# Altium schematic sheet DO_EZO_2.SchDoc
size A4
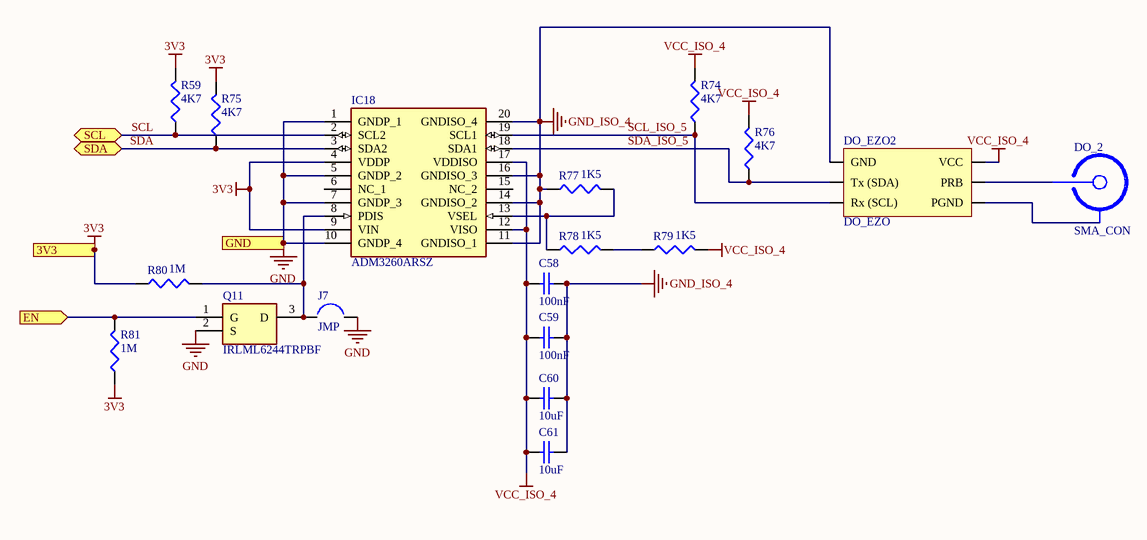
[diagram p0: DO_EZO_2.SchDoc]

## Parts
C58  100nF  [1608[0603]]
C59  100nF  [1608[0603]]
C60  10uF  [1608[0603]]
C61  10uF  [1608[0603]]
DO_2  SMA_CON  [PCBSMAFRAHT]
DO_EZO2  DO_EZO  [DO_EZO]
IC18  ADM3260ARSZ  [SOP65P780X200-20N]
J7  JMP  [Jumper]
Q11  IRLML6244TRPBF  [SOT95P237X112-3N]
R59  4K7  [J1-0603]
R74  4K7  [J1-0603]
R75  4K7  [J1-0603]
R76  4K7  [J1-0603]
R77  1K5  [J1-0603]
R78  1K5  [J1-0603]
R79  1K5  [J1-0603]
R80  1M  [J1-0603]
R81  1M  [J1-0603]

## Ports
3V3, EN (in), GND, SCL (bidir), SDA (bidir)

## Nets
3V3: IC18.4(VDDP) IC18.9(VIN) R59.2 R75.2 R80.1 R81.1 ; port 3V3
GND: IC18.1(GNDP_1) IC18.5(GNDP_2) IC18.7(GNDP_3) IC18.10(GNDP_4) J7.2 Q11.2(S) ; port GND
GND_ISO_4: C58.2 C59.2 C60.2 C61.2 DO_EZO2.1(GND) IC18.11(GNDISO_1) IC18.14(GNDISO_2) IC18.16(GNDISO_3) IC18.20(GNDISO_4) R77.1
VCC_ISO_4: C58.1 C59.1 C60.1 C61.1 DO_EZO2.4(VCC) IC18.12(VISO) IC18.17(VDDISO) R74.2 R76.2 R79.2
EN: Q11.1(G) R81.2 ; port EN
SCL: IC18.2(SCL2) R59.1 ; port SCL
SCL_ISO_5: DO_EZO2.3(Rx_(SCL)) IC18.19(SCL1) R74.1
SDA: IC18.3(SDA2) R75.1 ; port SDA
SDA_ISO_5: DO_EZO2.2(Tx_(SDA)) IC18.18(SDA1) R76.1
NetDO_2_1: DO_2.1 DO_EZO2.5(PRB)
NetDO_2_2: DO_2.2 DO_EZO2.6(PGND)
NetIC18_8: IC18.8(PDIS) J7.1 Q11.3(D) R80.2
NetIC18_13: IC18.13(VSEL) R77.2 R78.1
NetR78_2: R78.2 R79.1

Not connected (* = marked no-connect by the designer): IC18 6(NC_1) 15(NC_2)

## Library data of the parts
C58 C59 = Cap Semi: Capacitor (Semiconductor SIM Model); Published: 8-Jun-2000; LatestRevisionDate: 29-May-2009; LatestRevisionNote: IPC-7351 Footprint Added.; PackageReference: C1206; Publisher: Altium Limited; PackageDescription: Chip Capacitor; Value: 100nF
C60 C61 = Cap Semi: Capacitor (Semiconductor SIM Model); Value: 100nF; Published: 8-Jun-2000; LatestRevisionDate: 29-May-2009; LatestRevisionNote: IPC-7351 Footprint Added.; PackageReference: C1206; Publisher: Altium Limited; PackageDescription: Chip Capacitor
DO_2 = SMA: Connector; Manufacturer_Name: Taoglas; Manufacturer_Part_Number: PCB.SMAFRA.HT; Datasheet Link: https://www.mouser.com/datasheet/2/398/PCB.SMAFRA.HT_-1220750.pdf; Height: 9mm; Mouser Part Number: 960-PCB.SMAFRA.HT; Mouser Price/Stock: https://www.mouser.co.uk/ProductDetail/Taoglas/PCBSMAFRAHT?qs=RuW%2Fu%252BNMQmubIFYcN8w5Dw%3D%3D
IC18 = ADM3260ARSZ: Integrated Circuit; Manufacturer_Name: Analog Devices; Datasheet Link: http://www.farnell.com/datasheets/2037088.pdf; Height: 2mm; Manufacturer_Part_Number: ADM3260ARSZ; Mouser Part Number: 584-ADM3260ARSZ; Mouser Price/Stock: https://www.mouser.com/Search/Refine.aspx?Keyword=584-ADM3260ARSZ; RS Part Number: 8319113P; RS Price/Stock: http://uk.rs-online.com/web/p/products/8319113P
Q11 = IRLML6244TRPBF: Transistor; Manufacturer_Name: Infineon; Allied_Number: 70411468; Datasheet Link: http://www.infineon.com/dgdl/irlml6244pbf.pdf?fileId=5546d462533600a4015356686fed261f; Height: 1.12mm; Manufacturer_Part_Number: IRLML6244TRPBF; Mouser Part Number: 942-IRLML6244TRPBF; Mouser Price/Stock: https://www.mouser.com/Search/Refine.aspx?Keyword=942-IRLML6244TRPBF; RS Part Number: 7377228P; RS Price/Stock: http://at.rs-online.com/web/p/products/7377228P; Allied Price/Stock: https://www.alliedelec.com/infineon-irlml6244trpbf/70411468/
R59 R74-R81 = Res3: Resistor; Published: 8-Jun-2000; LatestRevisionDate: 29-May-2009; LatestRevisionNote: IPC-7351 Footprint Added.; PackageReference: J1-0603; Publisher: Altium Limited; PackageDescription: Chip Resistor
  R59 R74-R76: Value: 4K7
  R77-R79: Value: 1K5
  R80 R81: Value: 1M